# EAGLE design main_plate (EAGLE 9.1.0)
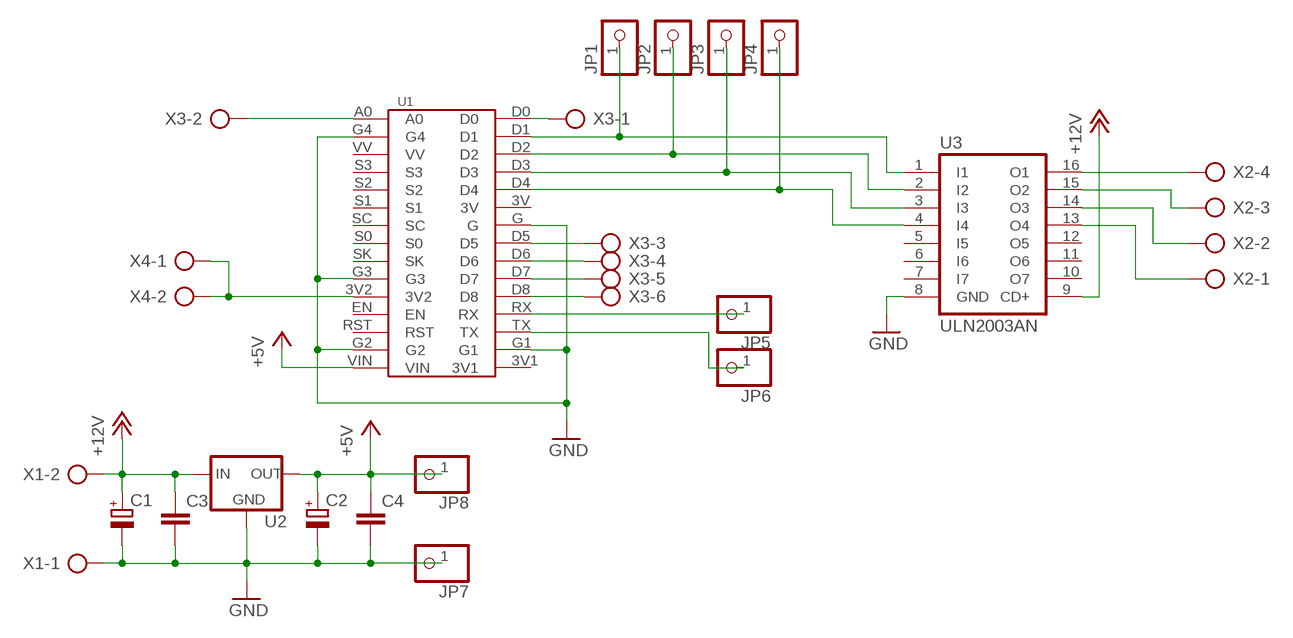
[diagram p0: schematic, sheet 1]

## Parts
C1  CPOL-EUE3.5-8  [E3,5-8]
C2  CPOL-EUE3.5-8  [E3,5-8]
C3  C-EU025-025X050  [C025-025X050]
C4  C-EU025-025X050  [C025-025X050]
JP1  PINHD-1X1  [1X01]
JP2  PINHD-1X1  [1X01]
JP3  PINHD-1X1  [1X01]
JP4  PINHD-1X1  [1X01]
JP5  PINHD-1X1  [1X01]
JP6  PINHD-1X1  [1X01]
JP7  PINHD-1X1  [1X01]
JP8  PINHD-1X1  [1X01]
U1  LOLIN  [LOLIN]
U2  78XXS  [78XXS]
U3  ULN2003AN  [DIL16]
X1  AK300/2  [AK300/2]
X2  AK300/4  [AK300/4]
X3  AK300/6  [AK300/6]
X4  AK300/2  [AK300/2]

## Nets
+5V: C2.+ C4.1 JP8.1 U1.VIN U2.OUT
+12V: C1.+ C3.1 U2.IN U3.9(CD+) X1.2
GND: C1.- C2.- C3.2 C4.2 JP7.1 U1.G U1.G1 U1.G2 U1.G3 U1.G4 U2.GND U3.8(GND) X1.1
N$1: U1.D0 X3.1
N$2: U3.16(O1) X2.4
N$3: U3.15(O2) X2.3
N$4: U3.14(O3) X2.2
N$5: U3.13(O4) X2.1
N$6: U1.D8 X3.6
N$7: U1.D7 X3.5
N$8: U1.D6 X3.4
N$9: JP1.1 U1.D1 U3.1(I1)
N$10: JP2.1 U1.D2 U3.2(I2)
N$11: JP3.1 U1.D3 U3.3(I3)
N$12: JP4.1 U1.D4 U3.4(I4)
N$13: U1.D5 X3.3
N$14: JP5.1 U1.RX
N$15: JP6.1 U1.TX
N$16: U1.A0 X3.2
N$17: U1.3V2 X4.1 X4.2
Unconnected: U1.3V U1.3V1 U1.EN U1.RST U1.S0 U1.S1 U1.S2 U1.S3 U1.SC U1.SK U1.VV U3.5(I5) U3.6(I6) U3.7(I7) U3.10(O7) U3.11(O6) U3.12(O5)

## Library data of the parts
C1 C2 = rcl:CPOL-EU: POLARIZED CAPACITOR, European symbol; SPICEPREFIX: C
C3 C4 = rcl:C-EU: CAPACITOR, European symbol; SPICEPREFIX: C
JP1-JP8 = pinhead:PINHD-1X1: PIN HEADER
U1 = Lolin:LOLIN
U2 = v-reg:78XXS: VOLTAGE REGULATOR
U3 = uln-udn:ULN2003A: DRIVER ARRAY
X1 X4 = con-ptr500:AK300/2: CONNECTOR; OC_FARNELL: unknown; OC_NEWARK: unknown
X2 = con-ptr500:AK300/4: CONNECTOR; OC_FARNELL: unknown; OC_NEWARK: unknown
X3 = con-ptr500:AK300/6: CONNECTOR; OC_FARNELL: unknown; OC_NEWARK: unknown

## Board
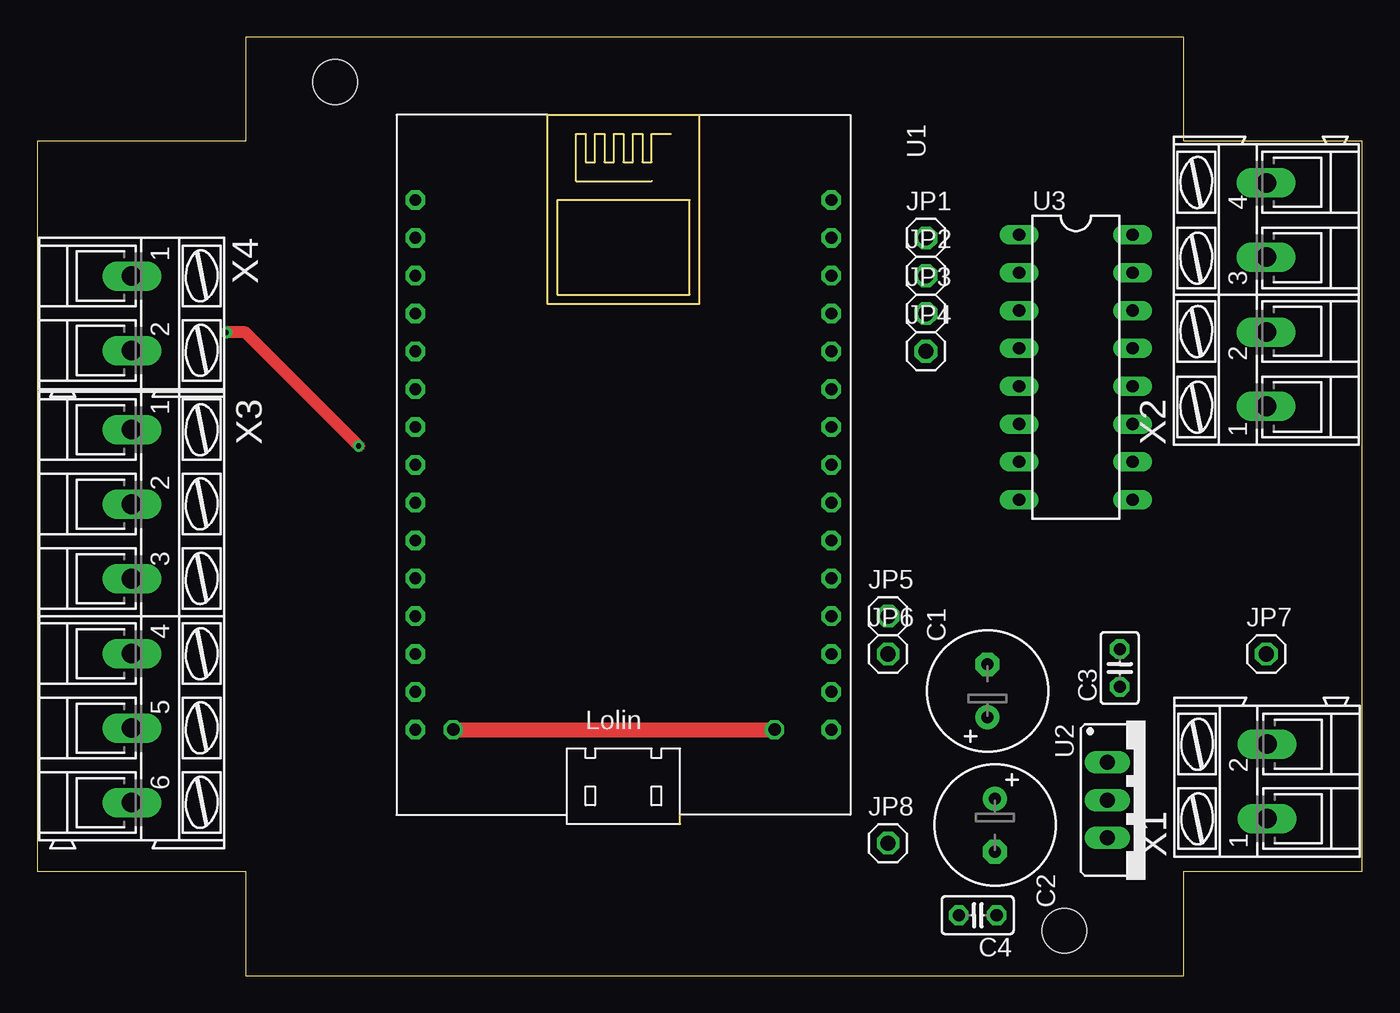
[diagram p1: board, top side]
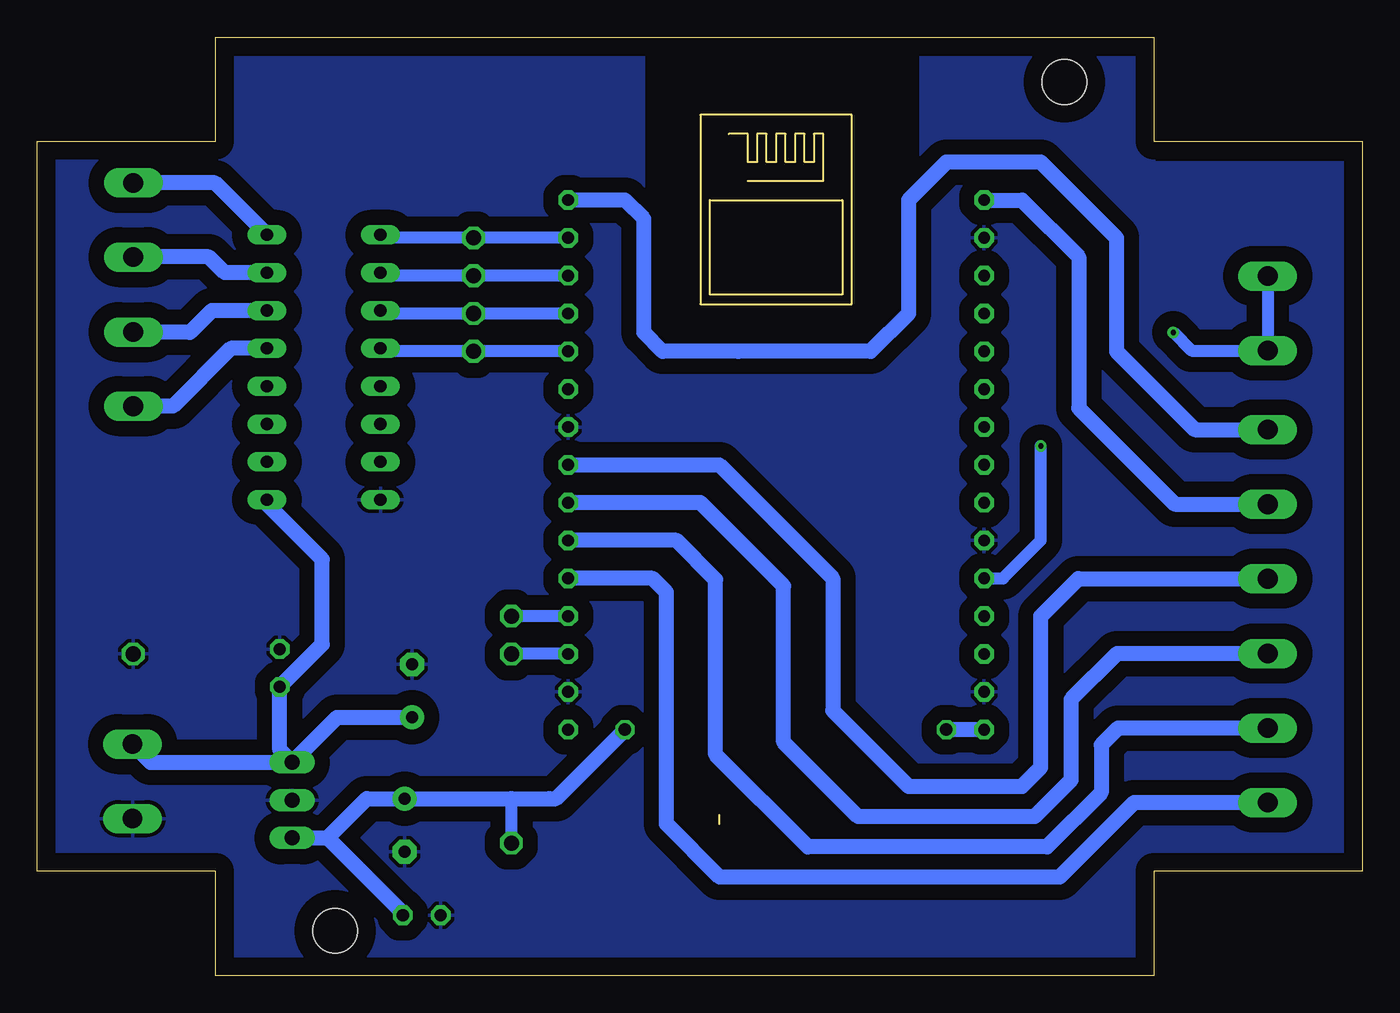
[diagram p2: board, bottom side, seen from below]

Size 89 x 63 mm. Coordinates in mm from the lower left corner, seen from the top.
Outline: 14,0 77,0 77,7 89,7 89,9 89,10 89,56 87,56 77,56 77,63 14,63 14,56 0,56 0,7 14,7 14,0
Copper layers (1*16): Top 0.035mm / dielectric 1.5mm / Bottom 0.035mm
Design rules "default *": minimum track width 6mil, minimum drill 0.35mm, track to track 40mil, track to pad 40mil, pad to pad 24mil, via to via 6mil, smd to smd 6mil, copper to edge 48mil, drill to drill 6mil, minimum pad ring 10mil, minimum via ring 8mil, stop-mask expansion 4mil, vias tented up to drill 0mil, thermal gap 10mil
Holes 3 mm at 20,60 69,3

### Footprints (pad centres in the part's own frame; a part is rotated, then mirrored left to right if it is on the bottom)
E3,5-8 = drill 0.813 pad 1.6: + -1.778,0 | drill 0.813 pad 1.6 octagon: - 1.778,0
C025-025X050 = drill 0.813 octagon: 1 -1.27,0; 2 1.27,0
1X01 = drill 1.016 octagon: 1 0,0
LOLIN = drill 0.8 octagon: 3V -6.35,13.97; 3V1 16.51,13.97; 3V2 6.35,-13.97; A0 -19.05,-13.97; D0 -19.05,13.97; D1 -16.51,13.97; D2 -13.97,13.97; D3 -11.43,13.97; D4 -8.89,13.97; D5 -1.27,13.97; D6 1.27,13.97; D7 3.81,13.97; D8 6.35,13.97; EN 8.89,-13.97; G -3.81,13.97; G1 13.97,13.97; G2 13.97,-13.97; G3 3.81,-13.97; G4 -16.51,-13.97; RST 11.43,-13.97; RX 8.89,13.97; S0 -1.27,-13.97; S1 -6.35,-13.97; S2 -8.89,-13.97; S3 -11.43,-13.97; SC -3.81,-13.97; SK 1.27,-13.97; TX 11.43,13.97; VIN 16.51,-13.97; VV -13.97,-13.97
78XXS = drill 1.016 long: GND 0,-2.54; IN -2.54,-2.54; OUT 2.54,-2.54
DIL16 = drill 0.813 long: 1 -8.89,-3.81; 2 -6.35,-3.81; 3 -3.81,-3.81; 4 -1.27,-3.81; 5 1.27,-3.81; 6 3.81,-3.81; 7 6.35,-3.81; 8 8.89,-3.81; 9 8.89,3.81; 10 6.35,3.81; 11 3.81,3.81; 12 1.27,3.81; 13 -1.27,3.81; 14 -3.81,3.81; 15 -6.35,3.81; 16 -8.89,3.81
AK300/2 = drill 1.321 long: 1 -2.515,0; 2 2.489,0
AK300/4 = drill 1.321 long: 1 -7.493,0; 2 -2.515,0; 3 2.515,0; 4 7.493,0
AK300/6 = drill 1.321 long: 1 -12.522,0; 2 -7.518,0; 3 -2.515,0; 4 2.515,0; 5 7.518,0; 6 12.522,0

### Placement (x,y rotation side)
C1  63.83,19.11 90 top
C2  64.33,10.1 270 top
C3  72.71,20.65 90 top
C4  63.17,4.05 180 top
JP1  59.69,49.53 0 top
JP2  59.69,46.99 0 top
JP3  59.69,44.45 0 top
JP4  59.69,41.91 0 top
JP5  57.15,24.13 0 top
JP6  57.15,21.59 0 top
JP7  82.55,21.59 0 top
JP8  57.15,8.89 0 top
U1  39.37,33.02 270 top
U2  74.42,11.78 270 top
U3  69.76,40.84 270 top
X1  82.6,13.05 90 top
X2  82.55,45.72 90 top
X3  6.35,24.13 270 top
X4  6.35,44.45 270 top

### Tracks (layer width: path | path; a pad name or v marks a point on that pad's centre or on a via)
+5V  (via drill 0.85)
  Top 1.016: v27.94,16.51 v49.53,16.51
  Bottom 0.813: JP8.1 57.15,11.88
  Bottom 1.016: U2.OUT 69.5,9.24 | 69.5,9.24 66.86,11.88 C2.+ 57.15,11.88 54.61,11.88 54.16,11.88 v49.53,16.51 | 69.5,9.24 64.44,4.18 C4.1 | U1.VIN v27.94,16.51
+12V
  Bottom 1.016: X1.2 81.38,14.32 U2.IN | U2.IN 72.71,15.15 C3.1 69.85,22.24 69.85,27.94 73.57,31.66 U3.9 | U2.IN 68.87,17.33 C1.+
GND
  pour Bottom: 0,7.62 13.97,7.62 13.97,0 76.2,0 76.2,6.35 76.2,7.62 88.9,7.62 88.9,55.88 76.2,55.88 76.2,62.23 48.26,62.23 48.26,44.45 44.45,44.45 29.69,44.45 29.69,62.23 13.97,62.23 13.97,54.61 0,54.61
N$1
  Bottom 1.016: 27.94,54.61 21.59,54.61 16.51,49.53 16.51,41.91 11.25,36.65 X3.1 | 27.94,54.61 | 27.94,54.61 30.48,52.07 30.48,49.53 30.48,44.45 33.02,41.91 41.91,41.91 46.99,41.91 48.26,43.18 48.26,50.8 49.53,52.07 U1.D0
N$2
  Bottom 1.016: U3.16 77.05,53.21 X2.4
N$3
  Bottom 1.016: U3.15 76.4,47.19 77.47,48.26 82.55,48.26 X2.3
N$4
  Bottom 1.016: U3.14 77.27,44.65 78.74,43.18 82.53,43.18 X2.2
N$5
  Bottom 1.016: 82.42,38.23 X2.1 79.88,38.23 76,42.11 U3.13
N$6
  Bottom 1.016: X3.6 15.33,11.61 20.34,6.6 43.16,6.6 46.74,10.18 46.74,25.75 47.66,26.67 U1.D8
N$7
  Bottom 1.016: X3.5 16.41,16.61 17.53,15.49 17.53,12.29 21.18,8.64 37.24,8.64 43.43,14.83 43.43,26.59 46.05,29.21 U1.D7
N$8
  Bottom 1.016: X3.4 16.48,21.61 19.56,18.54 19.56,13.13 22.02,10.67 33.86,10.67 38.86,15.67 38.86,26.16 44.45,31.75 U1.D6
N$9
  Bottom 0.813: U1.D1 JP1.1 65.75,49.53 U3.1
N$10
  Bottom 0.813: U1.D2 JP2.1 65.75,46.99 U3.2
N$11
  Bottom 0.813: U1.D3 JP3.1 65.75,44.45 U3.3
N$12
  Bottom 0.813: U1.D4 JP4.1 65.75,41.91 U3.4
N$13
  Bottom 1.016: X3.3 19.07,26.64 21.59,24.13 21.59,13.97 22.86,12.7 30.48,12.7 35.56,17.78 35.56,26.67 43.18,34.29 U1.D5
N$14
  Bottom 0.813: U1.RX JP5.1
N$15
  Bottom 0.813: U1.TX JP6.1
N$16
  Bottom 1.016: U1.A0 22.86,52.07 19.05,48.26 19.05,38.1 12.6,31.65 X3.2
N$17  (via drill 0.35)
  Top 0.813: v21.59,35.56 13.97,43.18 v12.7,43.18
  Bottom 0.813: U1.3V2 24.13,26.67 21.59,29.21 v21.59,35.56 | v12.7,43.18 11.48,41.96 X4.2 X4.1